# Altium project SAMA7D65-Curiosity.PrjPcb (part 1 of 12)
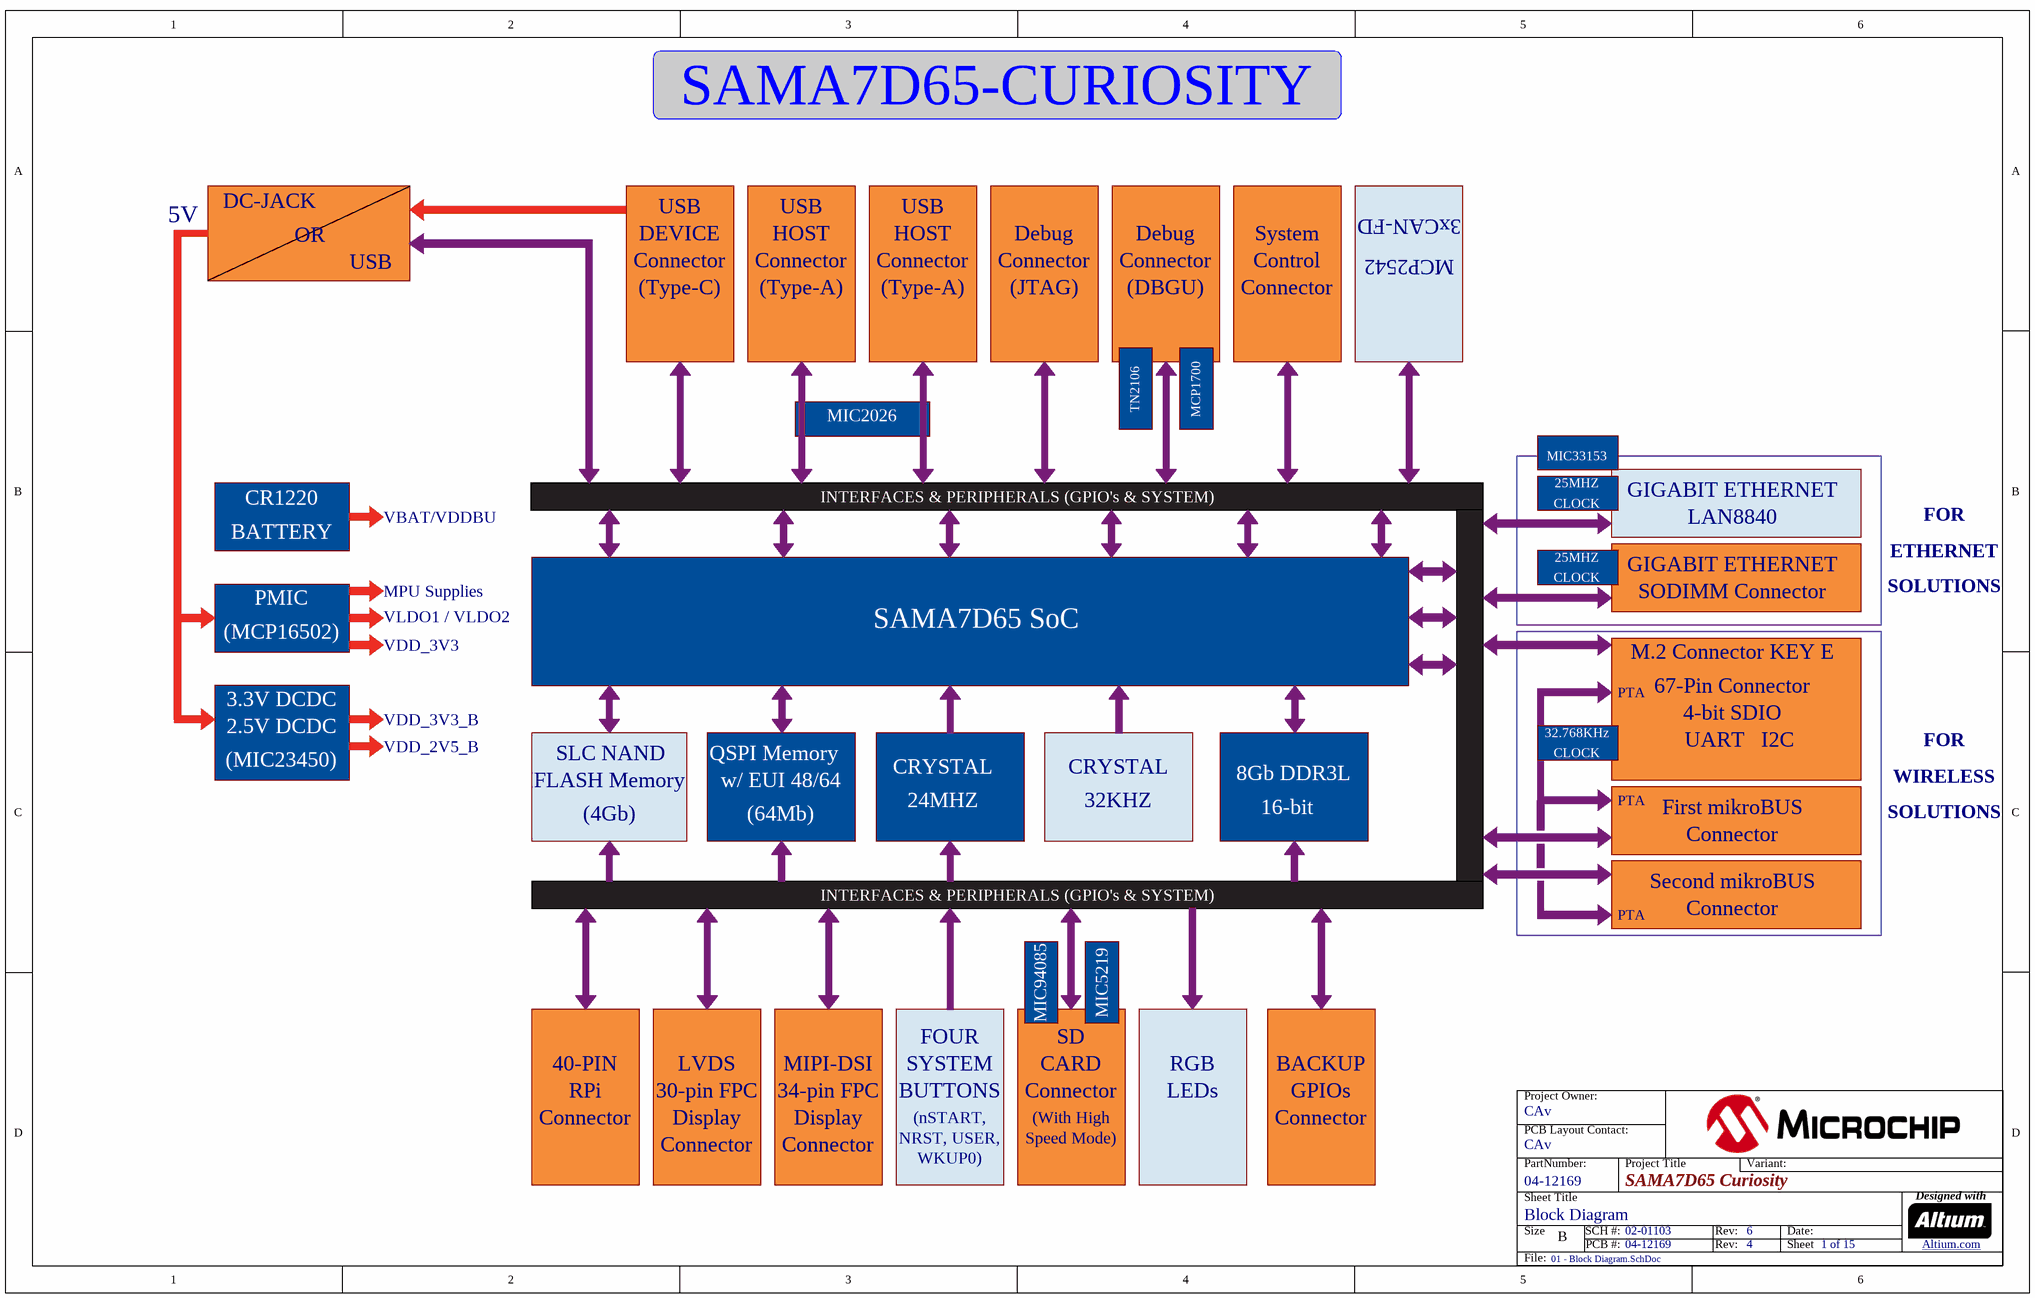
[diagram p0: 01 - Block Diagram.SchDoc]
ProjectTitle: SAMA7D65 Curiosity; ProjectPCBFabRevision: 4; ProjectPCBFabNumber: 04-12169; ProjectPCBAssyRevision: 6; ProjectPCBAssyNumber: 02-01103; ProjectPartNumber: 04-12169; ProjectContactPCB: CAv; ProjectContactOwner: CAv
15 sheets, 624 parts. Net scope: flat (ports and power ports of the same name join across sheets).
Board file: SAMA7D65-Curiosity.PcbDoc
Sheets:
  01 - Block Diagram.SchDoc
  02 - PIO muxing.SchDoc
  03 - Power.SchDoc
  04 - PMIC-PWR Monitor.SchDoc
  05 - SAMA7D65-MPU.SchDoc
  06 - SAMA7D65-DDR3L.SchDoc
  07 - SAMA7D65-PIO.SchDoc
  08 - Memories.SchDoc
  09 - M.2-SDMMC2.SchDoc
  10 - GMAC0.SchDoc
  11 - GMAC1-SODIMM.SchDoc
  12 - MIPI-LVDS-RGB.SchDoc
  13 - USB.SchDoc
  14 - mBUS-CAN.SchDoc
  15 - LED-User-Debug.SchDoc

## Sheet 01 - Block Diagram.SchDoc
size B; CompanyName: Microchip Technology Inc.; Organization: Microchip Technology; Address1: 2355 West Chandler Blvd.; Address2: Chandler, AZ  85224; Address4: USA; DocumentNumber: 1; SheetNumber: 1; SheetTotal: 15; SheetTitle: Block Diagram; Time: Time

### Notes on the sheet
- SAMA7D65-CURIOSITY
- 5V
- DC-JACK
- OR
- DEVICE
- USB
- HOST
- Debug
- System
- 3xCAN-FD
- (Type-C)
- Connector
- (Type-A)
- (JTAG)
- (DBGU)
- Control
- MCP2542
- MIC2026
- TN2106
- MCP1700
- CR1220
- VBAT/VDDBU
- INTERFACES & PERIPHERALS (GPIO's & SYSTEM)
- 25MHZ
- CLOCK
- MIC33153
- LAN8840
- GIGABIT ETHERNET
- FOR
- BATTERY
- ETHERNET
- PMIC
- (MCP16502)
- MPU Supplies
- VLDO1 / VLDO2
- VDD_3V3
- SAMA7D65 SoC
- M.2 Connector KEY E
- SODIMM Connector
- SOLUTIONS
- 1.8V DCDC
- 3.3V DCDC
- PTA
- 67-Pin Connector
- 4-bit SDIO
- (MIC5353)
- 2.5V DCDC
- (MIC23450)
- VDD_3V3_B
- VDD_2V5_B
- FLASH Memory
- SLC NAND
- QSPI Memory
- w/ EUI 48/64
- CRYSTAL
- 8Gb DDR3L
- 32.768KHz
- UART   I2C
- WIRELESS
- (4Gb)
- (64Mb)
- 24MHZ
- 32KHZ
- 16-bit
- First mikroBUS
- Second mikroBUS
- MIC94085
- MIC5219
- FOUR
- SD
- RPi
- 40-PIN
- LVDS
- Display
- 30-pin FPC
- MIPI-DSI
- 34-pin FPC
- SYSTEM
- BUTTONS
- (nSTART,
- CARD
- (With High
- RGB
- LEDs
- BACKUP
- GPIOs
- NRST, USER,
- WKUP0)
- Speed Mode)
- Project Owner:
- PCB Layout Contact:
- PartNumber:
- Project Title
- Variant:
- Sheet Title
- Size
- B
- SCH #:
- PCB #:
- Rev:
- Date:
- Sheet
- Designed with
- Altium.com <http://go.altium.com/MicrochipLandingPage_Evaluation.html>
- File:

## Sheet 02 - PIO muxing.SchDoc
size B; CompanyName: Microchip Technology Inc.; Organization: Microchip Technology; Address1: 2355 West Chandler Blvd.; Address2: Chandler, AZ  85224; Address4: USA; DocumentNumber: 2; SheetNumber: 2; SheetTotal: 15; SheetTitle: PIO Muxing; Time: Time
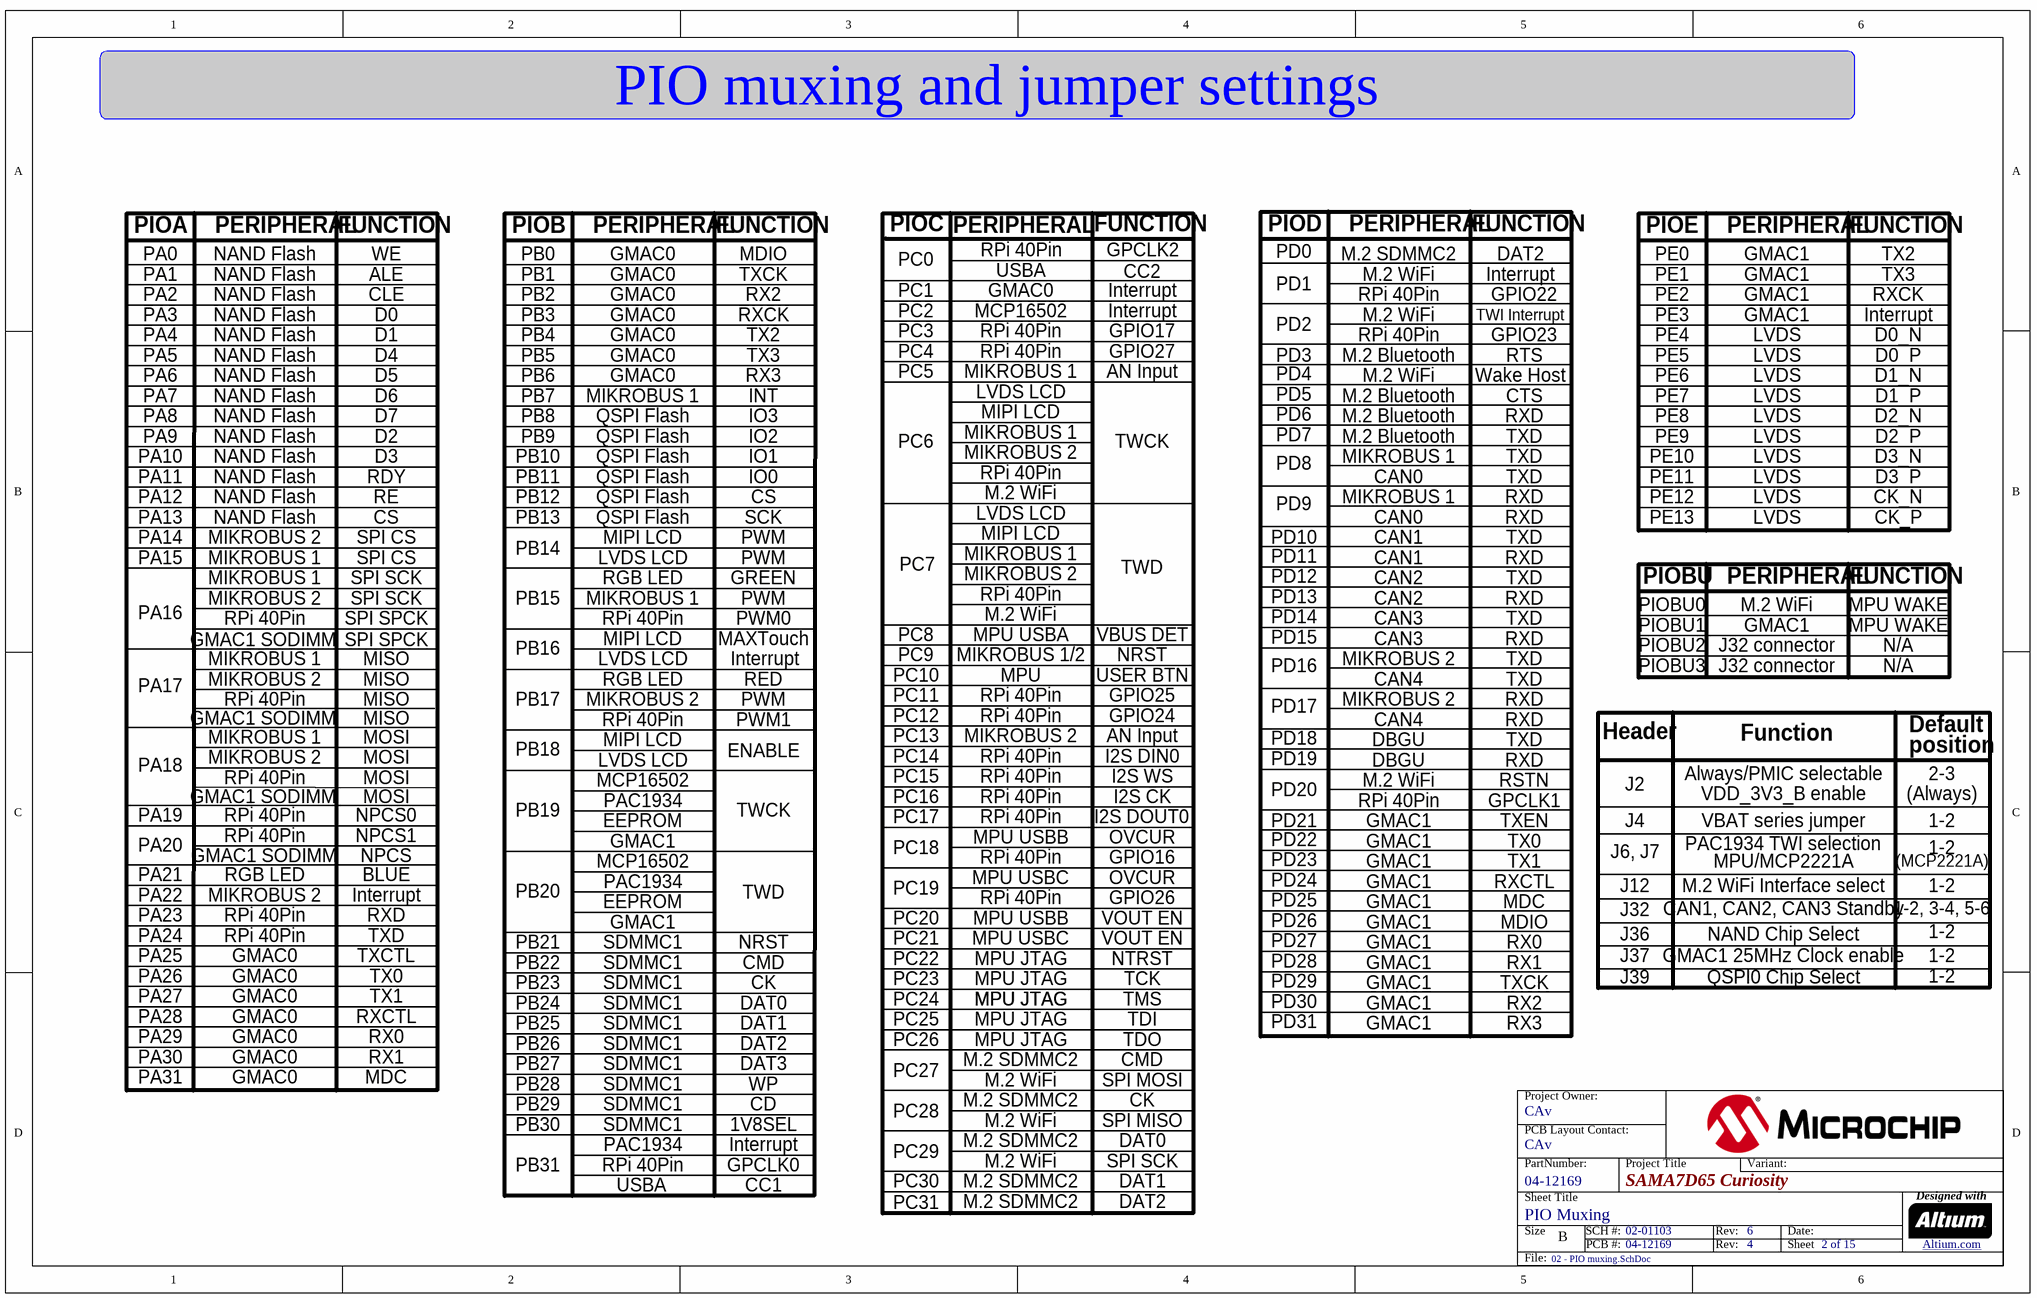
[diagram p1: 02 - PIO muxing.SchDoc]

### Notes on the sheet
- PIO muxing and jumper settings
- PIOA
- PERIPHERAL
- FUNCTION
- PIOB
- PIOC
- PIOD
- PIOE
- PA0
- PA1
- PA2
- NAND Flash
- WE
- ALE
- CLE
- PB0
- PB1
- PB2
- GMAC0
- MDIO
- TXCK
- RX2
- PC0
- PC1
- PC2
- MCP16502
- USBA
- RPi 40Pin
- Interrupt
- CC2
- GPCLK2
- PD0
- PD1
- M.2 SDMMC2
- M.2 WiFi
- DAT2
- GPIO22
- PE0
- PE1
- PE2
- GMAC1
- TX2
- TX3
- RXCK
- PA3
- PA4
- PA5
- PA6
- D0
- D1
- D4
- D5
- PB3
- PB4
- PB5
- PB6
- RX3
- PC3
- PC4
- PC5
- MIKROBUS 1
- GPIO17
- GPIO27
- AN Input
- PD2
- PD3
- PD4
- M.2 Bluetooth
- TWI Interrupt
- Wake Host
- GPIO23
- RTS
- PE3
- PE4
- PE5
- PE6
- LVDS
- D0_N
- D0_P
- D1_N
- PA7
- PA8
- PA9
- D2
- D6
- D7
- PB7
- PB8
- PB9
- QSPI Flash
- INT
- IO3
- IO2
- PC6
- LVDS LCD
- MIPI LCD
- TWCK
- PD5
- PD6
- PD7
- CTS
- RXD
- TXD
- PE7
- PE8
- PE9
- D2_P
- D1_P
- D2_N
- PA10
- PA11
- PA12
- PA13
- D3
- RDY
- RE
- CS
- PB10
- PB11
- PB12
- PB13
- IO1
- IO0
- SCK
- MIKROBUS 2
- PD8
- PD9
- CAN0
- PE10
- PE11
- PE12
- PE13
- D3_N
- D3_P
- CK_N
- CK_P
- PA14
- PA15
- SPI CS
- SPI SCK
- PB14
- RGB LED
- PWM
- GREEN
- PC7
- TWD
- PD10
- PD11
- PD12
- CAN1
- CAN2
- PA16
- GMAC1 SODIMM
- SPI SPCK
- PB15
- PB16
- PWM0
- MAXTouch
- PC8
- MPU USBA
- VBUS DET
- PD13
- PD14
- PD15
- CAN3
- PIOBU
- PIOBU0
- PIOBU1
- PIOBU2
- J32 connector
- MPU WAKE
- N/A
- PA17
- MISO
- PB17
- RED
- PC9
- PC10
- PC11
- PC12
- MIKROBUS 1/2
- MPU
- NRST
- USER BTN
- GPIO25
- GPIO24
- PD16
- PD17
- CAN4
- PIOBU3
- PA18
- MOSI
- PB18
- PWM1
- ENABLE
- PC13
- PC14
- PC15
- I2S DIN0
- I2S WS
- PD18
- PD19
- DBGU
- RSTN
- Header
- J2
- Always/PMIC selectable
- Function
- Default
- position
- 2-3
- PA19
- PA20
- NPCS0
- NPCS1
- PB19
- PAC1934
- EEPROM
- PC16
- PC17
- PC18
- MPU USBB
- I2S DOUT0
- I2S CK
- OVCUR
- PD20
- PD21
- PD22
- GPCLK1
- TXEN
- TX0
- J4
- J6, J7
- PAC1934 TWI selection
- VDD_3V3_B enable
- VBAT series jumper
- (Always)
- 1-2
- PA21
- PA22
- PA23
- BLUE
- NPCS
- PB20
- PC19
- PC20
- MPU USBC
- GPIO16
- GPIO26
- VOUT EN
- PD23
- PD24
- PD25
- PD26
- TX1
- RXCTL
- MDC
- J12
- J32
- MPU/MCP2221A
- M.2 WiFi Interface select
- CAN1, CAN2, CAN3 Standby
- (MCP2221A)
- 1-2, 3-4, 5-6
- PA24
- PA25
- PA26
- TXCTL
- PB21
- PB22
- PB23
- SDMMC1
- CMD
- CK
- PC21
- PC22
- PC23
- MPU JTAG
- NTRST
- TCK
- PD27
- PD28
- PD29
- RX0
- RX1
- J36
- J39
- J37
- NAND Chip Select
- QSPI0 Chip Select
- GMAC1 25MHz Clock enable
- PA27
- PA28
- PA29
- PA30
- PB24
- PB25
- PB26
- DAT0
- DAT1
- PC24
- PC25
- PC26
- TMS
- TDI
- TDO
- PD30
- PD31
- PA31
- PB27
- PB28
- PB29
- DAT3
- WP
- CD
- PC27
- PC28
- SPI MOSI
- SPI MISO
- PB30
- PB31
- 1V8SEL
- GPCLK0
- CC1
- PC29
- PC30
- PC31
- Project Owner:
- PCB Layout Contact:
- PartNumber:
- Project Title
- Variant:
- Sheet Title
- Size
- B
- SCH #:
- PCB #:
- Rev:
- Date:
- Sheet
- Designed with
- Altium.com <http://go.altium.com/MicrochipLandingPage_Evaluation.html>
- File:

## Sheet 03 - Power.SchDoc
size B; CompanyName: Microchip Technology Inc.; Organization: Microchip Technology; Address1: 2355 West Chandler Blvd.; Address2: Chandler, AZ  85224; Address4: USA; DocumentNumber: 3; SheetNumber: 3; SheetTotal: 15; SheetTitle: Power Supply
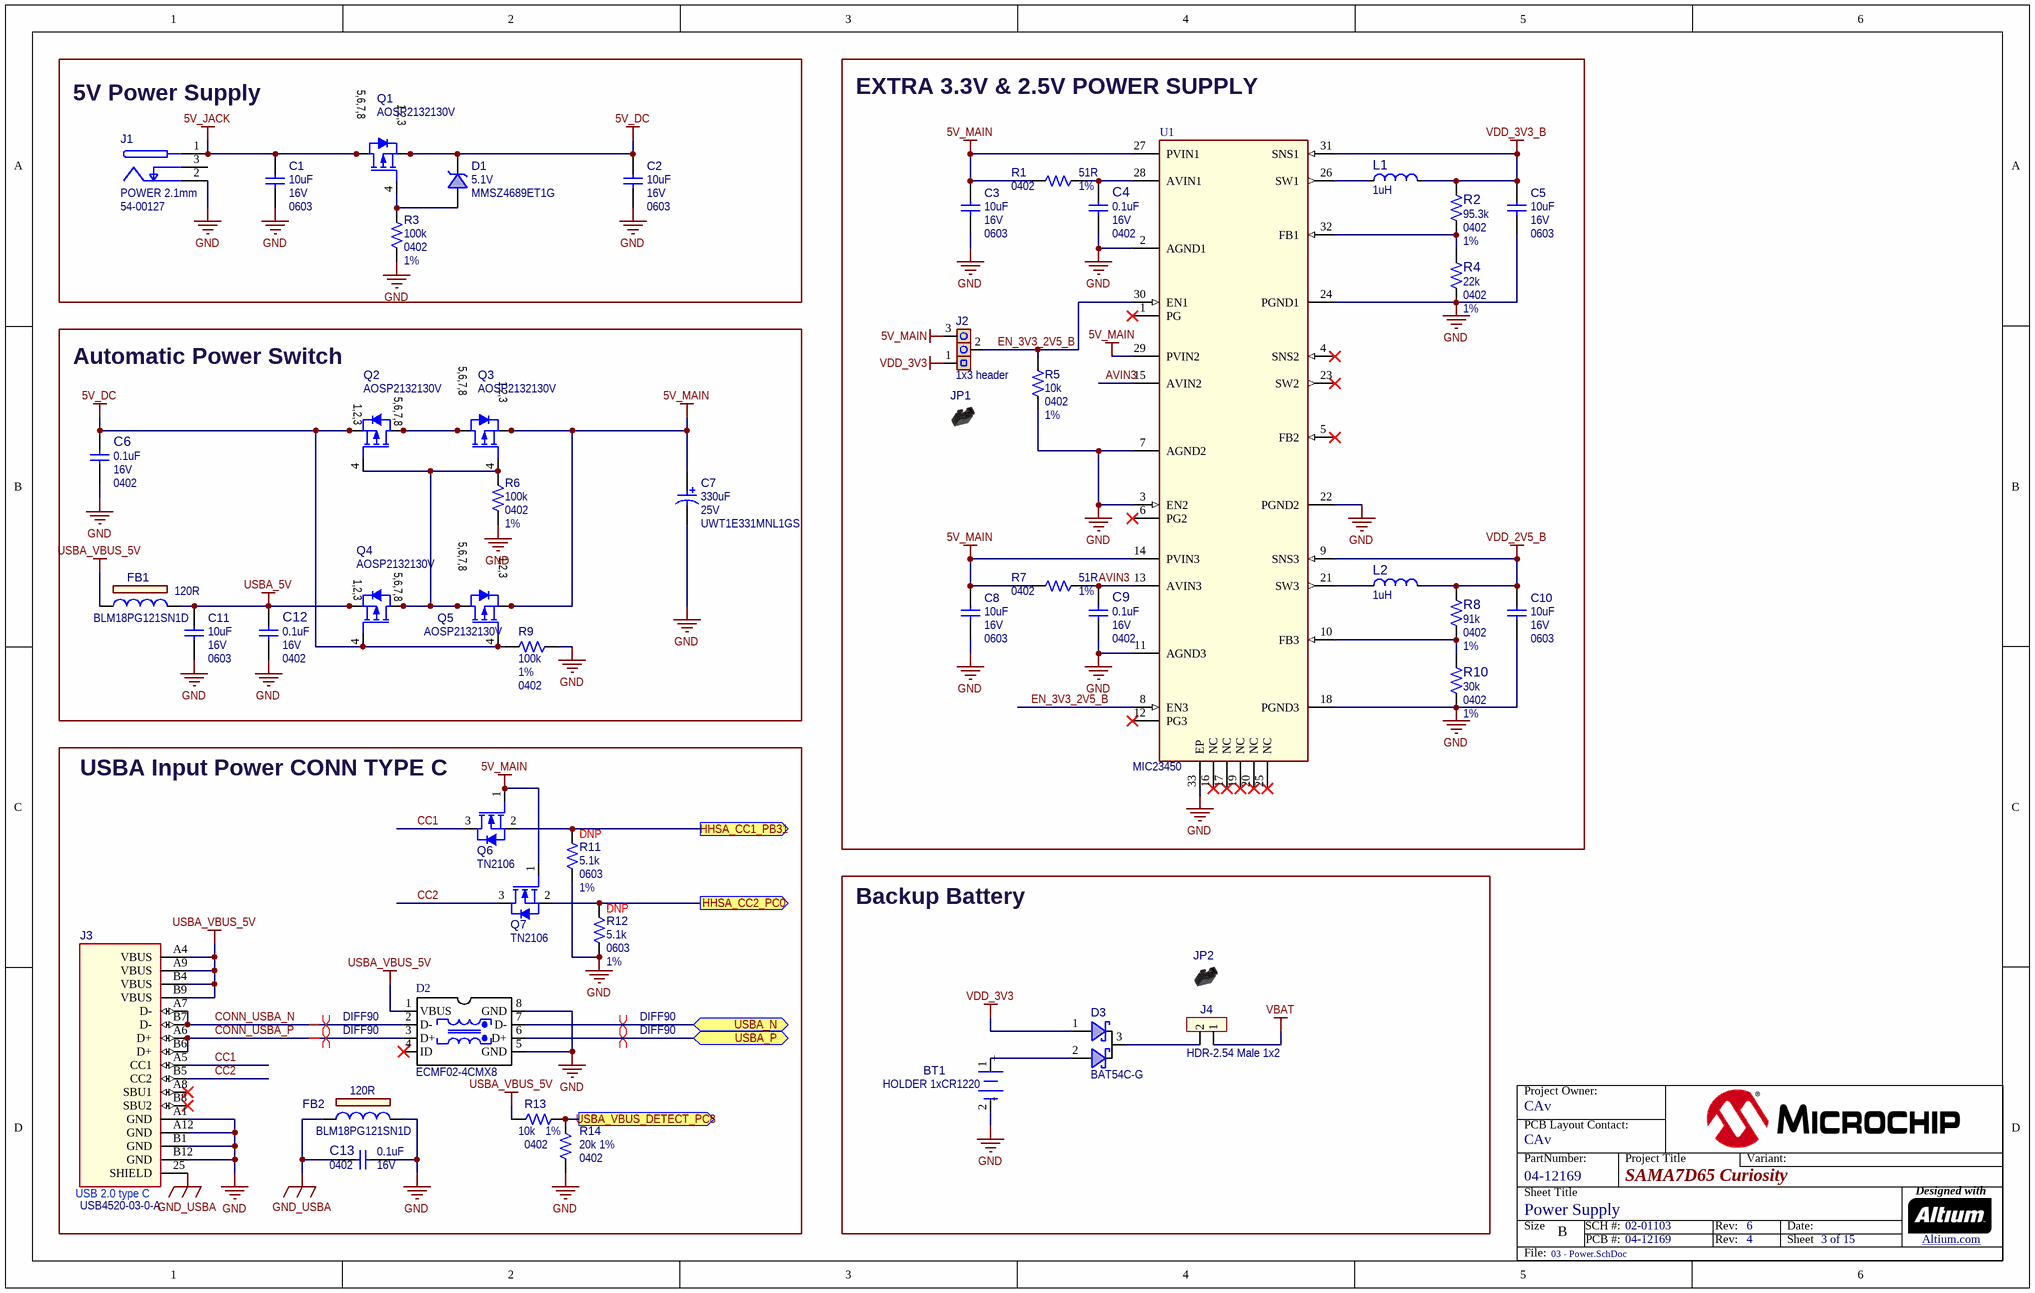
[diagram p2: 03 - Power.SchDoc]

### Parts
BT1  value HOLDER 1xCR1220  [BATT_HOLDER_12MM_3001]  (hidden comment: Battery 2 Pin)
C1  value 10uF  Voltage: 16V  Package: 0603  [CAP_C_0603]  (hidden comment: Capacitor NP)
C2  value 10uF  Voltage: 16V  Package: 0603  [CAP_C_0603]  (hidden comment: Capacitor NP)
C3  value 10uF  Voltage: 16V  Package: 0603  [CAP_C_0603]  (hidden comment: Capacitor NP)
C4  value 0.1uF  Voltage: 16V  Package: 0402  [CAP_C_0402]  (hidden comment: Capacitor NP)
C5  value 10uF  Voltage: 16V  Package: 0603  [CAP_C_0603]  (hidden comment: Capacitor NP)
C6  value 0.1uF  Voltage: 16V  Package: 0402  [CAP_C_0402]  (hidden comment: Capacitor NP)
C7  value 330uF  Voltage: 25V  Manufacturer Part Number 1: UWT1E331MNL1GS  [CAP_AL_F]  (hidden comment: Capacitor POL)
C8  value 10uF  Voltage: 16V  Package: 0603  [CAP_C_0603]  (hidden comment: Capacitor NP)
C9  value 0.1uF  Voltage: 16V  Package: 0402  [CAP_C_0402]  (hidden comment: Capacitor NP)
C10  value 10uF  Voltage: 16V  Package: 0603  [CAP_C_0603]  (hidden comment: Capacitor NP)
C11  value 10uF  Voltage: 16V  Package: 0603  [CAP_C_0603]  (hidden comment: Capacitor NP)
C12  value 0.1uF  Voltage: 16V  Package: 0402  [CAP_C_0402]  (hidden comment: Capacitor NP)
C13  value 0.1uF  Voltage: 16V  Package: 0402  [CAP_C_0402]  (hidden comment: Capacitor NP)
D1  value 5.1V  Manufacturer Part Number 1: MMSZ4689ET1G  [SOD-123]  (hidden comment: Diode Zener)
D2  value ECMF02-4CMX8  [DIODE ESD ECMF02-4CMX8]  (hidden comment: ESD_ECMF02-4CMX8)
D3  value BAT54C-G  [SOT-23-3]  (hidden comment: Diode Schottky Dual CK)
FB1  value 120R  Manufacturer Part Number 1: BLM18PG121SN1D  [IND_C_0603]  (hidden comment: Ferrite Bead)
FB2  value 120R  Manufacturer Part Number 1: BLM18PG121SN1D  [IND_C_0603]  (hidden comment: Ferrite Bead)
J1  value POWER 2.1mm  Manufacturer Part Number 1: 54-00127  [CON_JACK_POWER_TH_RA_PJ-ID2.10 OD5.50]  (hidden comment: CON JACK 2C 3P SPST)
J2  value 1x3 header  [HDR_M_2.54_1x3]  (hidden comment: Header 1x3)
J3  value USB4520-03-0-A  [CON_USB2.0-C_SMD_RA_USB4520]  (hidden comment: CON USB-2.0 C)
J4  value HDR-2.54 Male 1x2  [HDR_M_2.54_1x2]  (hidden comment: Header 1x2)
JP1  Jumper Mechanical  [Jumper_Mechanical]  (value not drawn)  (mechanical)
JP2  Jumper Mechanical  [Jumper_Mechanical]  (value not drawn)  (mechanical)
L1  value 1uH  [IND_C_1212]  (hidden comment: Inductor)
L2  value 1uH  [IND_C_1212]  (hidden comment: Inductor)
Q1  value AOSP2132130V  [SOIC-8]  (hidden comment: Transistor MOS-P SSSGDDDD)
Q2  value AOSP2132130V  [SOIC-8]  (hidden comment: Transistor MOS-P SSSGDDDD)
Q3  value AOSP2132130V  [SOIC-8]  (hidden comment: Transistor MOS-P SSSGDDDD)
Q4  value AOSP2132130V  [SOIC-8]  (hidden comment: Transistor MOS-P SSSGDDDD)
Q5  value AOSP2132130V  [SOIC-8]  (hidden comment: Transistor MOS-P SSSGDDDD)
Q6  value TN2106  [SOT-23-3]  (hidden comment: Transistor MOS-N GSD)
Q7  value TN2106  [SOT-23-3]  (hidden comment: Transistor MOS-N GSD)
R1  value 51R  Package: 0402  Tolerance: 1%  [RES_C_0402]  (hidden comment: Resistor)
R2  value 95.3k  Package: 0402  Tolerance: 1%  [RES_C_0402]  (hidden comment: Resistor)
R3  value 100k  Package: 0402  Tolerance: 1%  [RES_C_0402]  (hidden comment: Resistor)
R4  value 22k  Package: 0402  Tolerance: 1%  [RES_C_0402]  (hidden comment: Resistor)
R5  value 10k  Package: 0402  Tolerance: 1%  [RES_C_0402]  (hidden comment: Resistor)
R6  value 100k  Package: 0402  Tolerance: 1%  [RES_C_0402]  (hidden comment: Resistor)
R7  value 51R  Package: 0402  Tolerance: 1%  [RES_C_0402]  (hidden comment: Resistor)
R8  value 91k  Package: 0402  Tolerance: 1%  [RES_C_0402]  (hidden comment: Resistor)
R9  value 100k  Package: 0402  Tolerance: 1%  [RES_C_0402]  (hidden comment: Resistor)
R10  value 30k  Package: 0402  Tolerance: 1%  [RES_C_0402]  (hidden comment: Resistor)
R11  value 5.1k  Package: 0603  Tolerance: 1%  Populated: DNP  [RES_C_0603]  (hidden comment: Resistor)
R12  value 5.1k  Package: 0603  Tolerance: 1%  Populated: DNP  [RES_C_0603]  (hidden comment: Resistor)
R13  value 10k  Package: 0402  Tolerance: 1%  [RES_C_0402]  (hidden comment: Resistor)
R14  value 20k  Package: 0402  Tolerance: 1%  [RES_C_0402]  (hidden comment: Resistor)
U1  value MIC23450  [QFN-32_5X5_EP3.1X3.1]  (hidden comment: MIC23450 QFN-32)

### Blocks framed on the sheet
5V Power Supply: C1 C2 D1 J1 Q1 R3
EXTRA 3.3V & 2.5V POWER SUPPLY: C3-C5 C8-C10 J2 JP1 L1 L2 R1 R2 R4 R5 R7 R8 R10 U1
Automatic Power Switch: C6 C7 C11 C12 FB1 Q2-Q5 R6 R9
USBA Input Power CONN TYPE C: C13 D2 FB2 J3 Q6 Q7 R11-R14
Backup Battery: BT1 D3 J4 JP2

### Ports
HHSA_CC1_PB31 (out), HHSA_CC2_PC0 (out), USBA_N (bidir), USBA_P (bidir), USBA_VBUS_DETECT_PC8 (out)

### Nets
5V_DC: C2.1 C6.2 D1.2(K) Q1.1(S) Q1.2(S) Q1.3(S) Q2.1(S) Q2.2(S) Q2.3(S) Q4.4(G) Q5.4(G) R9.2
5V_JACK: C1.1 J1.1(PLUS) Q1.5(D) Q1.6(D) Q1.7(D) Q1.8(D)
5V_MAIN: C3.1 C7.1 C8.1 J2.3 Q3.1(S) Q3.2(S) Q3.3(S) Q5.1(S) Q5.2(S) Q5.3(S) Q6.1(G) Q7.1(G) R1.2 R7.2 U1.14(PVIN3) U1.27(PVIN1) U1.29(PVIN2)
GND: BT1.2(-) C1.2 C2.2 C3.2 C4.1 C5.2 C6.1 C7.2 C8.2 C9.1 C10.2 C11.2 C12.1 C13.2 D2.5(GND) D2.8(GND) FB2.2 J1.2(COM) J3.A1(GND) J3.A12(GND) J3.B1(GND) J3.B12(GND) R3.1 R4.1 R5.1 R6.1 R9.1 R10.1 R11.2 R12.2 R14.1 U1.2(AGND1) U1.3(EN2) U1.7(AGND2) U1.11(AGND3) U1.18(PGND3) U1.22(PGND2) U1.24(PGND1) U1.33(EP)
GND_USBA: C13.1 FB2.1 J3.25(SHIELD)
USBA_5V: C11.1 C12.2 FB1.2 Q4.1(S) Q4.2(S) Q4.3(S)
USBA_VBUS_5V: D2.1(VBUS) FB1.1 J3.A4(VBUS) J3.A9(VBUS) J3.B4(VBUS) J3.B9(VBUS) R13.1
VBAT: J4.1
VDD_2V5_B: C10.1 L2.2(F) R8.1 U1.9(SNS3)
VDD_3V3: D3.1(A) J2.1
VDD_3V3_B: C5.1 L1.2(F) R2.1 U1.31(SNS1)
AVIN3: C9.2 R7.1 U1.13(AVIN3) U1.15(AVIN2)
CC1: J3.A5(CC1) Q6.3(D)
CC2: J3.B5(CC2) Q7.3(D)
CONN_USBA_N: D2.2(D-) J3.A7(D-) J3.B7(D-)
CONN_USBA_P: D2.3(D+) J3.A6(D+) J3.B6(D+)
EN_3V3_2V5_B: J2.2 R5.2 U1.8(EN3) U1.30(EN1)
HHSA_CC1_PB31: Q6.2(S) R11.1 ; port HHSA_CC1_PB31
HHSA_CC2_PC0: Q7.2(S) R12.1 ; port HHSA_CC2_PC0
USBA_N: D2.7(D-) ; port USBA_N
USBA_P: D2.6(D+) ; port USBA_P
USBA_VBUS_DETECT_PC8: R13.2 R14.2 ; port USBA_VBUS_DETECT_PC8
NetBT1_1: BT1.1(+) D3.2(A)
NetC4_2: C4.2 R1.1 U1.28(AVIN1)
NetD1_1: D1.1(A) Q1.4(G) R3.2
NetD3_3: D3.3(KK) J4.2
NetL1_1: L1.1(S) U1.26(SW1)
NetL2_1: L2.1(S) U1.21(SW3)
NetQ2_4: Q2.4(G) Q3.4(G) Q4.5(D) Q4.6(D) Q4.7(D) Q4.8(D) Q5.5(D) Q5.6(D) Q5.7(D) Q5.8(D) R6.2
NetQ2_5: Q2.5(D) Q2.6(D) Q2.7(D) Q2.8(D) Q3.5(D) Q3.6(D) Q3.7(D) Q3.8(D)
NetR2_2: R2.2 R4.2 U1.32(FB1)
NetR8_2: R8.2 R10.2 U1.10(FB3)

Not connected (* = marked no-connect by the designer): D2 4(ID)*; J1 3(SWITCH); J3 A8(SBU1)* B8(SBU2)*; U1 1(PG)* 4(SNS2)* 5(FB2)* 6(PG2)* 12(PG3)* 16(NC)* 17(NC)* 19(NC)* 20(NC)* 23(SW2)* 25(NC)*

### Layout directives
differential pair; differential pair class DIFF90; net class DIFF90; rule Matched Net Lengths [Tolerance = 4mil]: CONN_USBA_N, CONN_USBA_P, USBA_N, USBA_P

### Notes on the sheet
- Project Owner:
- PCB Layout Contact:
- PartNumber:
- Project Title
- Variant:
- Sheet Title
- Size
- B
- SCH #:
- PCB #:
- Rev:
- Date:
- Sheet
- Designed with
- Altium.com <http://go.altium.com/MicrochipLandingPage_Evaluation.html>
- File:
- (in symbol CON2634) USB 2.0 type C
- (in symbol TRA1639) 5,6,7,8; 1,2,3

### Library data of the parts
BT1 = BAT1034: Battery; Manufacturer 1: Keystone Electronics; Manufacturer Part Number 1: 3001; Description_: BATT HOLDER 1 COIN 12MM TH 3V; Dev Tools Status: Design; Owner: Sam Charles; Voltage: 3V; Chemistry: Li; Capacity: 35mAh; Populated: YES; MCHP-ID: BAT1034; Revision: A; Symbol: Battery 2 Pin; Status: MCL Design; ComponentLink1URL: https://chn-vm-apps.microchip.com/mchprepo/parts/Datasheets/3001.PDF; ComponentLink1Description: SVN Datasheet; ComponentLink2URL: C:\ALTIUM_WORK\00001_MCHP-CDB\Datasheets\3001.PDF; ComponentLink2Description: Local Datasheet; ComponentLink3URL: C:\ALTIUM_WORK\00001_MCHP-CDB\Library\LibraryRefs\Battery 2 Pin.SchLib; ComponentLink3Description: Open Symbol; ComponentLink4URL: C:\ALTIUM_WORK\00001_MCHP-CDB\Library\Footprints\BATT_HOLDER_12MM_3001.PcbLib; ComponentLink4Description: Open Footprint; ComponentLink5Description: Open Footprint 2; ComponentLink6Description: Open Footprint 3; ComponentLink7Description: Open Footprint 4; Type: Holder; Category: Battery; Supplier 1: Digi-Key; Supplier Part Number 1: 36-3001-ND; Quantity Override: 1
C1-C3 C5 C8 C10 C11 = CAP2397: Manufacturer 1: Murata; Manufacturer Part Number 1: GRT188R61C106KE13D; Description_: CAP CER 10uF 16V 10% X5R SMD 0603 AEC-Q200; Dev Tools Status: Design; Tolerance: 10%; Temperature Coefficient: X5R; Type: Ceramic; Populated: YES; Owner: Sam Charles; MCHP-ID: CAP2397; Revision: 1; Symbol: Capacitor NP; Status: MCL Design; ComponentLink1URL: https://chn-vm-apps.microchip.com/mchprepo/parts/Datasheets/GRT188R61C106KE13-01.pdf; ComponentLink1Description: SVN Datasheet; ComponentLink2URL: C:\ALTIUM_WORK\00001_MCHP-CDB\Datasheets\GRT188R61C106KE13-01.pdf; ComponentLink2Description: Local Datasheet; ComponentLink3URL: C:\ALTIUM_WORK\00001_MCHP-CDB\Library\LibraryRefs\Capacitor NP.SchLib; ComponentLink3Description: Open Symbol; ComponentLink4URL: C:\ALTIUM_WORK\00001_MCHP-CDB\Library\Footprints\CAP_C_0603.PcbLib; ComponentLink4Description: Open Footprint; ComponentLink5Description: Open Footprint 2; ComponentLink6Description: Open Footprint 3; ComponentLink7Description: Open Footprint 4; Operating Temperature: -55°C ~ 85°C; Category: Capacitor; Supplier 1: Digi-Key; Supplier Part Number 1: 490-12317-1-ND; Quantity Override: 1
C4 C6 C9 C12 = CAP1033: Manufacturer 1: Hottech; Manufacturer Part Number 1: C1005B104K160NT; Description_: CAP CER 0.1uF 16V 10% X7R SMD 0402; Dev Tools Status: Production; Tolerance: 10%; Type: Ceramic; Owner: Sompoch Loboonlert; Populated: Yes; Temperature Coefficient: X7R; Restricted Sourcing: No; MCHP-ID: CAP1033; Revision: 10; Symbol: Capacitor NP; Status: MCL Design; ComponentLink1URL: https://chn-vm-apps.microchip.com/mchprepo/parts/Datasheets/L0005E.pdf; ComponentLink1Description: SVN Datasheet; ComponentLink2URL: C:\ALTIUM_WORK\00001_MCHP-CDB\Datasheets\L0005E.pdf; ComponentLink2Description: Local Datasheet; ComponentLink3URL: C:\ALTIUM_WORK\00001_MCHP-CDB\Library\LibraryRefs\Capacitor NP.SchLib; ComponentLink3Description: Open Symbol; ComponentLink4URL: C:\ALTIUM_WORK\00001_MCHP-CDB\Library\Footprints\CAP_C_0402.PcbLib; ComponentLink4Description: Open Footprint; ComponentLink5Description: Open Footprint 2; ComponentLink6Description: Open Footprint 3; ComponentLink7Description: Open Footprint 4; Operating Temperature: -55C to +125C; Category: Capacitor; Manufacturer 2: KEMET; Manufacturer Part Number 2: C0402C104K4RAC7867; Manufacturer 3: Samsung Electro-Mechanics; Manufacturer Part Number 3: CL05B104KO5NNNC; Supplier 1: Hottech; Supplier Part Number 1: C1005B104K160NT; Supplier 2: Digi-Key; Supplier Part Number 2: 399-C0402C104K4RAC7867TR-ND; Supplier 3: Digi-Key; Supplier Part Number 3: 1276-1001-1-ND; Quantity Override: 1; Manufacturer 4: Würth Elektronik; Manufacturer Part Number 4: 885012205037; Manufacturer 5: Samsung Electro-Mechanics; Manufacturer Part Number 5: CL05B104KO5NNND; Manufacturer 6: Samsung Electro-Mechanics; Manufacturer Part Number 6: CL05B104KO5NNNO; Manufacturer 7: Yageo; Manufacturer Part Number 7: CC0402KRX7R7BB104; Supplier 4: Digi-Key; Supplier Part Number 4: 732-7532-1-ND; Supplier 5: Mouser; Supplier Part Number 5: 187-CL05B104KO5NNND; Supplier 6: Samsung Electro-Mechanics; Supplier Part Number 6: CL05B104KO5NNNO; Supplier 7: Yageo; Supplier Part Number 7: CC0402KRX7R7BB104
C7 = CAP0508: Capacitor; Manufacturer 1: Nichicon; Description_: CAP ALU 330uF 25V 20% SMD F; Dev Tools Status: Production; Tolerance: 20%; Type: Aluminum; Populated: YES; MCHP-ID: CAP0508; Package: AL-F; Revision: 1; Symbol: Capacitor POL; Status: MCL Design; ComponentLink1URL: https://chn-vm-apps.microchip.com/mchprepo/parts/Datasheets/e-wt.pdf; ComponentLink1Description: SVN Datasheet; ComponentLink2URL: C:\ALTIUM_WORK\00001_MCHP-CDB\Datasheets\e-wt.pdf; ComponentLink2Description: Local Datasheet; ComponentLink3URL: C:\ALTIUM_WORK\00001_MCHP-CDB\Library\LibraryRefs\Capacitor POL.SchLib; ComponentLink3Description: Open Symbol; ComponentLink4URL: C:\ALTIUM_WORK\00001_MCHP-CDB\Library\Footprints\CAP_AL_F.PcbLib; ComponentLink4Description: Open Footprint; ComponentLink5Description: Open Footprint 2; ComponentLink6Description: Open Footprint 3; ComponentLink7Description: Open Footprint 4; Operating Temperature: -55C to +105C; Category: Capacitor; Supplier 1: Digi-Key; Supplier Part Number 1: 493-2193-1-ND; Quantity Override: 1
C13 = CAP1033: Manufacturer 1: Hottech; Manufacturer Part Number 1: C1005B104K160NT; Description_: CAP CER 0.1uF 16V 10% X7R SMD 0402; Dev Tools Status: Production; Tolerance: 10%; Temperature Coefficient: X7R; Type: Ceramic; Owner: Sompoch Loboonlert; Populated: Yes; Restricted Sourcing: No; MCHP-ID: CAP1033; Revision: 10; Symbol: Capacitor NP; Status: MCL Design; ComponentLink1URL: https://chn-vm-apps.microchip.com/mchprepo/parts/Datasheets/L0005E.pdf; ComponentLink1Description: SVN Datasheet; ComponentLink2URL: C:\ALTIUM_WORK\00001_MCHP-CDB\Datasheets\L0005E.pdf; ComponentLink2Description: Local Datasheet; ComponentLink3URL: C:\ALTIUM_WORK\00001_MCHP-CDB\Library\LibraryRefs\Capacitor NP.SchLib; ComponentLink3Description: Open Symbol; ComponentLink4URL: C:\ALTIUM_WORK\00001_MCHP-CDB\Library\Footprints\CAP_C_0402.PcbLib; ComponentLink4Description: Open Footprint; ComponentLink5Description: Open Footprint 2; ComponentLink6Description: Open Footprint 3; ComponentLink7Description: Open Footprint 4; Operating Temperature: -55C to +125C; Category: Capacitor; Supplier 1: Hottech; Supplier Part Number 1: C1005B104K160NT; Quantity Override: 1; Manufacturer 2: KEMET; Manufacturer Part Number 2: C0402C104K4RAC7867; Manufacturer 3: Samsung Electro-Mechanics; Manufacturer Part Number 3: CL05B104KO5NNNC; Manufacturer 4: Würth Elektronik; Manufacturer Part Number 4: 885012205037; Manufacturer 5: Samsung Electro-Mechanics; Manufacturer Part Number 5: CL05B104KO5NNND; Manufacturer 6: Samsung Electro-Mechanics; Manufacturer Part Number 6: CL05B104KO5NNNO; Manufacturer 7: Yageo; Manufacturer Part Number 7: CC0402KRX7R7BB104; Supplier 2: Digi-Key; Supplier Part Number 2: 399-C0402C104K4RAC7867TR-ND; Supplier 3: Digi-Key; Supplier Part Number 3: 1276-1001-1-ND; Supplier 4: Digi-Key; Supplier Part Number 4: 732-7532-1-ND; Supplier 5: Mouser; Supplier Part Number 5: 187-CL05B104KO5NNND; Supplier 6: Samsung Electro-Mechanics; Supplier Part Number 6: CL05B104KO5NNNO; Supplier 7: Yageo; Supplier Part Number 7: CC0402KRX7R7BB104
D1 = DIODE1230: Manufacturer 1: Fairchild Semiconductor; Description_: DIO ZNR MMSZ4689ET1G 5.1V 500mW SMD SOD-123; Dev Tools Status: Design; Type: Zener Single; Forward Current: 10mA; Power: 500mW; Reverse Current: 10µA; Reverse Voltage: 3V; Owner: Cristian Papuc; Populated: YES; MCHP-ID: DIODE1230; Revision: 1; Symbol: Diode Zener; Status: MCL Design; Package: SOD-123; ComponentLink1URL: https://chn-vm-apps.microchip.com/mchprepo/parts/Datasheets/SZ,MMSZ4yyyET1G SeriesG_Series.pdf; ComponentLink1Description: SVN Datasheet; ComponentLink2URL: C:\ALTIUM_WORK\00001_MCHP-CDB\Datasheets\SZ,MMSZ4yyyET1G SeriesG_Series.pdf; ComponentLink2Description: Local Datasheet; ComponentLink3URL: C:\ALTIUM_WORK\00001_MCHP-CDB\Library\LibraryRefs\Diode Zener.SchLib; ComponentLink3Description: Open Symbol; ComponentLink4URL: C:\ALTIUM_WORK\00001_MCHP-CDB\Library\Footprints\SOD-123.PcbLib; ComponentLink4Description: Open Footprint; ComponentLink5Description: Open Footprint 2; ComponentLink6Description: Open Footprint 3; ComponentLink7Description: Open Footprint 4; Operating Temperature: -55C to +150C; Category: Diode; Supplier 1: Digi-Key; Supplier Part Number 1: MMSZ4689ET1GOSCT-ND; Quantity Override: 1
D2 = IC1580: IC ESD FILTER COMM MODE 8-UQFN; Manufacturer 1: STMicroelectronics; MCHP-ID: IC1580; Description_: IC FILTER ECMF02-4CMX8 COMMON MODE ESD QFN-8L; Dev Tools Status: Production; Owner: Dragos Danaila; Populated: YES; Restricted Sourcing: No; Vin: 16V; Revision: 1; Symbol: DIODE ESD ECMF02-4CMX8; Status: MCL Design; Package: QFN-8L; ComponentLink1URL: https://chn-vm-apps.microchip.com/mchprepo/parts/Datasheets/en.DM00039389.pdf; ComponentLink1Description: SVN Datasheet; ComponentLink2URL: C:\ALTIUM_WORK\00001_MCHP-CDB\Datasheets\en.DM00039389.pdf; ComponentLink2Description: Local Datasheet; ComponentLink3URL: C:\ALTIUM_WORK\00001_MCHP-CDB\Library\LibraryRefs\DIODE ESD ECMF02-4CMX8.SchLib; ComponentLink3Description: Open Symbol; ComponentLink4URL: C:\ALTIUM_WORK\00001_MCHP-CDB\Library\Footprints\DIODE ESD ECMF02-4CMX8.PcbLib; ComponentLink4Description: Open Footprint; ComponentLink5Description: Open Footprint 2; ComponentLink6Description: Open Footprint 3; ComponentLink7Description: Open Footprint 4; Operating Temperature: -40C to +125C; Type: Filter; Category: IC; Manufacturer Part Number 1: ECMF02-4CMX8; Supplier 1: Digi-Key; Supplier Part Number 1: 497-13420-1-ND; Quantity Override: 1
D3 = DIODE1841: Manufacturer 1: Comchip Technology; Description_: DIO SCTKY ARRAY BAT54C-G 520mV 200mA 30V SMD SOT-23-3; Dev Tools Status: Production; Type: Schottky Array; Forward Current: 200mA; Power: 225mW; Reverse Current: 2mA; Reverse Recovery Time: 5ns; Reverse Voltage: 30V; Owner: Cristina Salanti; Populated: YES; Restricted Sourcing: No; MCHP-ID: DIODE1841; Revision: 1; Symbol: Diode Schottky Dual CK; Status: MCL Design; Package: SOT-23-3; ComponentLink1URL: https://chn-vm-apps.microchip.com/mchprepo/parts/Datasheets/BAT54.pdf; ComponentLink1Description: SVN Datasheet; ComponentLink2URL: C:\ALTIUM_WORK\00001_MCHP-CDB\Datasheets\BAT54.pdf; ComponentLink2Description: Local Datasheet; ComponentLink3URL: C:\ALTIUM_WORK\00001_MCHP-CDB\Library\LibraryRefs\Diode Schottky Dual CK.SchLib; ComponentLink3Description: Open Symbol; ComponentLink4URL: C:\ALTIUM_WORK\00001_MCHP-CDB\Library\Footprints\SOT-23-3.PcbLib; ComponentLink4Description: Open Footprint; ComponentLink5Description: Open Footprint 2; ComponentLink6Description: Open Footprint 3; ComponentLink7Description: Open Footprint 4; Operating Temperature: -55C to +125C; Category: Diode; Manufacturer Part Number 1: BAT54C-G; Supplier 1: Digi-Key; Supplier Part Number 1: 641-1320-1-ND; Quantity Override: 1
FB1 FB2 = IND1009: Manufacturer 1: Murata; Description_: FERRITE BEAD 120 OHM 0603 1LN; Dev Tools Status: Production; Owner: Petnarong Chaijaroong; DCR: 0.05R; Saturation Current: 12A; Populated: Yes; Restricted Sourcing: No; MCHP-ID: IND1009; Revision: 0; Symbol: Ferrite Bead; Status: MCL Design; ComponentLink1URL: https://chn-vm-apps.microchip.com/mchprepo/parts/Datasheets/L0110S0100BLM18P.pdf; ComponentLink1Description: SVN Datasheet; ComponentLink2URL: C:\ALTIUM_WORK\00001_MCHP-CDB\Datasheets\L0110S0100BLM18P.pdf; ComponentLink2Description: Local Datasheet; ComponentLink3URL: C:\ALTIUM_WORK\00001_MCHP-CDB\Library\LibraryRefs\Ferrite Bead.SchLib; ComponentLink3Description: Open Symbol; ComponentLink4URL: C:\ALTIUM_WORK\00001_MCHP-CDB\Library\Footprints\IND_C_0603.PcbLib; ComponentLink4Description: Open Footprint; ComponentLink5Description: Open Footprint 2; ComponentLink6Description: Open Footprint 3; ComponentLink7Description: Open Footprint 4; Operating Temperature: -55C to +125C; Package: 0603; Type: Ferrite Bead; Category: Inductor; Supplier 1: digikey; Supplier Part Number 1: 490-1037-1-ND; Quantity Override: 1
J1 = CON2145: Manufacturer 1: Tensility International Corp; Description_: CON POWER 2.1mm 5.5mm SWITCH TH R/A; Dev Tools Status: Design; Populated: YES; Owner: Narasimha Murthy; Voltage: 48V; Current: 6A; Custom Parameters: 1; MCHP-ID: CON2145; Revision: 1; Symbol: CON JACK 2C 3P SPST; Status: MCL Design; ComponentLink1URL: https://chn-vm-apps.microchip.com/mchprepo/parts/Datasheets/54-00127.pdf; ComponentLink1Description: SVN Datasheet; ComponentLink2URL: C:\ALTIUM_WORK\00001_MCHP-CDB\Datasheets\54-00127.pdf; ComponentLink2Description: Local Datasheet; ComponentLink3URL: C:\ALTIUM_WORK\00001_MCHP-CDB\Library\LibraryRefs\CON JACK 2C 3P SPST.SchLib; ComponentLink3Description: Open Symbol; ComponentLink4URL: C:\ALTIUM_WORK\00001_MCHP-CDB\Library\Footprints\CON_JACK_POWER_TH_RA_PJ-ID2.10 OD5.50.PcbLib; ComponentLink4Description: Open Footprint; ComponentLink5Description: Open Footprint 2; ComponentLink6Description: Open Footprint 3; ComponentLink7Description: Open Footprint 4; Type: Power; Category: Connector; Supplier 1: Digi-Key; Supplier Part Number 1: 839-1510-ND; Quantity Override: 1; Operating Temperature: -25C to +85C; Assembly Type: TH
J2 = CON2491: Manufacturer 1: METZ CONNECT USA Inc.; Manufacturer Part Number 1: PR20203VBNN; Description_: CON HDR-2.54 Male 1x3 Gold 6.10MH TH VERT; Dev Tools Status: Production; Owner: Dragos Danaila; Current: 3A; Populated: YES; MCHP-ID: CON2491; Revision: 2; Symbol: Header 1x3; Status: MCL Design; ComponentLink1URL: https://chn-vm-apps.microchip.com/mchprepo/parts/Datasheets/Data_sheet_PR202XXVBNN.PDF; ComponentLink1Description: SVN Datasheet; ComponentLink2URL: C:\ALTIUM_WORK\00001_MCHP-CDB\Datasheets\Data_sheet_PR202XXVBNN.PDF; ComponentLink2Description: Local Datasheet; ComponentLink3URL: C:\ALTIUM_WORK\00001_MCHP-CDB\Library\LibraryRefs\Header 1x3.SchLib; ComponentLink3Description: Open Symbol; ComponentLink4URL: C:\ALTIUM_WORK\00001_MCHP-CDB\Library\Footprints\HDR_M_2.54_1x3.PcbLib; ComponentLink4Description: Open Footprint; ComponentLink5Description: Open Footprint 2; ComponentLink6Description: Open Footprint 3; ComponentLink7Description: Open Footprint 4; Type: Header 2.54mm; Category: Connector; Supplier 1: Digi-Key; Supplier Part Number 1: Deprecated_1849-1003-ND; Quantity Override: 1; Operating Temperature: -40C to +105C; Assembly Type: TH
J3 = CON2634: USB 2.0 type C connector; Manufacturer 1: GCT; Description_: CONN USB2.0 TYPE-C Female SMD/TH R/A; Dev Tools Status: Design; Owner: Ciprian Abramov; Voltage: 20V; Current: 6.25A; Populated: YES; MCHP-ID: CON2634; Revision: 1; Symbol: CON USB2.0 C; Status: MCL Design; ComponentLink1URL: https://chn-vm-apps.microchip.com/mchprepo/parts/Datasheets/usb4520.pdf; ComponentLink1Description: SVN Datasheet; ComponentLink2URL: C:\ALTIUM_WORK\00001_MCHP-CDB\Datasheets\usb4520.pdf; ComponentLink2Description: Local Datasheet; ComponentLink3URL: C:\ALTIUM_WORK\00001_MCHP-CDB\Library\LibraryRefs\CON USB2.0 C.SchLib; ComponentLink3Description: Open Symbol; ComponentLink4URL: C:\ALTIUM_WORK\00001_MCHP-CDB\Library\Footprints\CON_USB2.0-C_SMD_RA_USB4520.PcbLib; ComponentLink4Description: Open Footprint; ComponentLink5Description: Open Footprint 2; ComponentLink6Description: Open Footprint 3; ComponentLink7Description: Open Footprint 4; Type: USB; Category: Connector; Manufacturer Part Number 1: USB4520-03-0-A; Supplier 1: Digi-Key; Supplier Part Number 1: 2073-USB4520-03-0-ACT-ND; Quantity Override: 1; Operating Temperature: -20C to +85C; Assembly Type: SMD
J4 = CON1632: Manufacturer 1: Würth Elektronik; Manufacturer Part Number 1: 61300211121; Description_: CON HDR-2.54 Male 1x2 Gold 5.84MH TH VERT; Dev Tools Status: Production; Owner: Narasimha Murthy; Populated: YES; Voltage: 250V; Current: 3A; MCHP-ID: CON1632; Revision: 3; Symbol: Header 1x2; Status: MCL Design; ComponentLink1URL: https://chn-vm-apps.microchip.com/mchprepo/parts/Datasheets/6130xx11121.pdf; ComponentLink1Description: SVN Datasheet; ComponentLink2URL: C:\ALTIUM_WORK\00001_MCHP-CDB\Datasheets\6130xx11121.pdf; ComponentLink2Description: Local Datasheet; ComponentLink3URL: C:\ALTIUM_WORK\00001_MCHP-CDB\Library\LibraryRefs\Header 1x2.SchLib; ComponentLink3Description: Open Symbol; ComponentLink4URL: C:\ALTIUM_WORK\00001_MCHP-CDB\Library\Footprints\HDR_M_2.54_1x2.PcbLib; ComponentLink4Description: Open Footprint; ComponentLink5Description: Open Footprint 2; ComponentLink6Description: Open Footprint 3; ComponentLink7Description: Open Footprint 4; Type: Header 2.54mm; Category: Connector; Supplier 1: Digi-Key; Supplier Part Number 1: 732-5315-ND; Quantity Override: 1; Manufacturer 2: SHENZHEN JUNHAO ENGINEERING; Manufacturer Part Number 2: R-211-0211-0021-000; Supplier 2: SHENZHEN JUNHAO ENGINEERING; Supplier Part Number 2: R-211-0211-0021-000; Assembly Type: TH
JP1 JP2 = MECH0174: Manufacturer 1: Wurth Electronics Inc.; Manufacturer Part Number 1: 60900213421; Value: Shunt 2.54mm 1x2; Description_: MECH HW JUMPER 2.54mm 1x2 GOLD; Dev Tools Status: Production; Owner: Narasimha Murthy; Populated: MECH; MCHP-ID: MECH0174; Revision: 1; Symbol: Jumper Mechanical; Status: MCL Design; ComponentLink1URL: https://chn-vm-apps.microchip.com/mchprepo/parts/Datasheets/60900213421.pdf; ComponentLink1Description: SVN Datasheet; ComponentLink2URL: C:\ALTIUM_WORK\00001_MCHP-CDB\Datasheets\60900213421.pdf; ComponentLink2Description: Local Datasheet; ComponentLink3URL: C:\ALTIUM_WORK\00001_MCHP-CDB\Library\LibraryRefs\Jumper Mechanical.SchLib; ComponentLink3Description: Open Symbol; ComponentLink4URL: C:\ALTIUM_WORK\00001_MCHP-CDB\Library\Footprints\Jumper_Mechanical.PcbLib; ComponentLink4Description: Open Footprint; ComponentLink5Description: Open Footprint 2; ComponentLink6Description: Open Footprint 3; ComponentLink7Description: Open Footprint 4; Type: Jumper; Category: Hardware; Supplier 1: Digi-Key; Supplier Part Number 1: 732-2678-ND; Quantity Override: 1
L1 L2 = IND1912: Manufacturer 1: TDK; Manufacturer Part Number 1: VLS3012CX-1R0M-1; Description_: INDUCTOR 1uH 2.51A 20% SMD L3W3H1.2; Dev Tools Status: Design; Owner: Cristina Salanti; DCR: 0.044R; Saturation Current: 2.79A; RMS Current: 3.31A; Test Frequency: 1Mhz; Populated: YES; Restricted Sourcing: No; MCHP-ID: IND1912; Revision: 1; Symbol: INDUCTOR; Status: MCL Design; ComponentLink1URL: https://chn-vm-apps.microchip.com/mchprepo/parts/Datasheets/inductor_commercial_power_vls3012cx-1_en.pdf; ComponentLink1Description: SVN Datasheet; ComponentLink2URL: C:\ALTIUM_WORK\00001_MCHP-CDB\Datasheets\inductor_commercial_power_vls3012cx-1_en.pdf; ComponentLink2Description: Local Datasheet; ComponentLink3URL: C:\ALTIUM_WORK\00001_MCHP-CDB\Library\LibraryRefs\INDUCTOR.SchLib; ComponentLink3Description: Open Symbol; ComponentLink4URL: C:\ALTIUM_WORK\00001_MCHP-CDB\Library\Footprints\IND_C_1212.PcbLib; ComponentLink4Description: Open Footprint; ComponentLink5Description: Open Footprint 2; ComponentLink6Description: Open Footprint 3; ComponentLink7Description: Open Footprint 4; Operating Temperature: -40°C ~ +105°C; Package: 3012; Type: Inductor; Category: Inductor; Supplier 1: Mouser; Supplier Part Number 1: 810-VLS3012CX-1R0M-1; Quantity Override: 1
Q1-Q5 = TRA1639: Transistor MOS; Manufacturer 1: Alpha & Omega Semiconductor Inc.; Manufacturer Part Number 1: AOSP21321; Description_: TRANS FET P-CH AOSP2132130V 11A 3.1W SOIC-8; Dev Tools Status: Design; Type: FET; Current: 11A; Drain to Source Voltage: 30V; Gate to Source Voltage: 25V; Power: 3.1W; Populated: YES; Owner: Dragos Danaila; MCHP-ID: TRA1639; Revision: 1; Symbol: Transistor MOS-P SSSGDDDD; Status: MCL Design; Package: SOIC 8; ComponentLink1URL: https://chn-vm-apps.microchip.com/mchprepo/parts/Datasheets/AOSP21321.pdf; ComponentLink1Description: SVN Datasheet; ComponentLink2URL: C:\ALTIUM_WORK\00001_MCHP-CDB\Datasheets\AOSP21321.pdf; ComponentLink2Description: Local Datasheet; ComponentLink3URL: C:\ALTIUM_WORK\00001_MCHP-CDB\Library\LibraryRefs\Transistor MOS-P SSSGDDDD.SchLib; ComponentLink3Description: Open Symbol; ComponentLink4URL: C:\ALTIUM_WORK\00001_MCHP-CDB\Library\Footprints\SOIC-8.PcbLib; ComponentLink4Description: Open Footprint; ComponentLink5Description: Open Footprint 2; ComponentLink6Description: Open Footprint 3; ComponentLink7Description: Open Footprint 4; Operating Temperature: -55C to +150C; Category: Transistor; Supplier 1: Digi-Key; Supplier Part Number 1: 785-1795-2-ND; Quantity Override: 1
Q6 Q7 = MIC7420: Transistor MOS; Manufacturer 1: Microchip Technology; Manufacturer Part Number 1: TN2106K1-G; Description_: MCHP ANALOG MOSFET N-CH TN2106 60V 280mA 360mW 2.5R SOT23-3; Type: MOSFET; Dev Tools Status: Production; Owner: Ilie Galan; Populated: YES; MCHP-ID: MIC7420; Symbol: Transistor MOS-N GSD; Status: MCL Design; Revision: 1; Category: MCHP-Analog; ComponentLink1Description: SVN Datasheet; ComponentLink2URL: C:\ALTIUM_WORK\00001_MCHP-CDB\Datasheets\TN2106 B080913.pdf; ComponentLink2Description: Local Datasheet; ComponentLink3URL: C:\ALTIUM_WORK\00001_MCHP-CDB\Library\LibraryRefs\Transistor MOS-N GSD.SchLib; ComponentLink3Description: Open Symbol; ComponentLink4URL: C:\ALTIUM_WORK\00001_MCHP-CDB\Library\Footprints\SOT-23-3.PcbLib; ComponentLink4Description: Open Footprint; ComponentLink5Description: Open Footprint 2; ComponentLink6Description: Open Footprint 3; ComponentLink7Description: Open Footprint 4; Supplier 1: Microchip Technology; Supplier Part Number 1: TN2106K1-G; Quantity Override: 1
R1 R7 = RSMT1294: Manufacturer 1: Panasonic Electronic Components; Manufacturer Part Number 1: ERJ-PA2F51R0X; Description_: RES TKF 51R 1% 1/5W SMD 0402; Dev Tools Status: Design; Voltage: 50V; Temperature Coeffcient: 100ppm/C; Power: 1/5W; Owner: Dragos Danaila; Populated: YES; MCHP-ID: RSMT1294; Revision: 1; Symbol: Resistor; Status: MCL Design; ComponentLink1URL: https://chn-vm-apps.microchip.com/mchprepo/parts/Datasheets/AOA0000C331.pdf; ComponentLink1Description: SVN Datasheet; ComponentLink2URL: C:\ALTIUM_WORK\00001_MCHP-CDB\Datasheets\AOA0000C331.pdf; ComponentLink2Description: Local Datasheet; ComponentLink3URL: C:\ALTIUM_WORK\00001_MCHP-CDB\Library\LibraryRefs\Resistor.SchLib; ComponentLink3Description: Open Symbol; ComponentLink4URL: C:\ALTIUM_WORK\00001_MCHP-CDB\Library\Footprints\RES_C_0402.PcbLib; ComponentLink4Description: Open Footprint; ComponentLink5Description: Open Footprint 2; ComponentLink6Description: Open Footprint 3; ComponentLink7Description: Open Footprint 4; Operating Temperature: -55C to +155C; Category: Resistor; Type: RES SMD; Composition: TKF; Supplier 1: Digikey; Supplier Part Number 1: P124491CT-ND; Quantity Override: 1
R2 = RES2553: Manufacturer 1: Stackpole Electronics Inc; Manufacturer Part Number 1: RMCF0402FT95K3; Description_: RES TKF 95.3k 1% 1/16W SMD 0402 AEC-Q200; Dev Tools Status: Production; Temperature Coefficient: 100ppm/C; Power: 1/16W; Owner: Narasimha Murthy; Populated: YES; Restricted Sourcing: No; MCHP-ID: RES2553; Revision: 1; Symbol: RESISTOR; Status: MCL Design; ComponentLink1URL: https://chn-vm-apps.microchip.com/mchprepo/parts/Datasheets/sei-rmcf_rmcp.pdf; ComponentLink1Description: SVN Datasheet; ComponentLink2URL: C:\ALTIUM_WORK\00001_MCHP-CDB\Datasheets\sei-rmcf_rmcp.pdf; ComponentLink2Description: Local Datasheet; ComponentLink3URL: C:\ALTIUM_WORK\00001_MCHP-CDB\Library\LibraryRefs\RESISTOR.SchLib; ComponentLink3Description: Open Symbol; ComponentLink4URL: C:\ALTIUM_WORK\00001_MCHP-CDB\Library\Footprints\RES_C_0402.PcbLib; ComponentLink4Description: Open Footprint; ComponentLink5Description: Open Footprint 2; ComponentLink6Description: Open Footprint 3; ComponentLink7Description: Open Footprint 4; Operating Temperature: -55C to 155C; Category: Resistor; Type: RES SMD; Composition: TKF; Supplier 1: Digi-Key; Supplier Part Number 1: RMCF0402FT95K3CT-ND; Quantity Override: 1
R3 R6 R9 = RES1011: Manufacturer 1: Panasonic; Manufacturer Part Number 1: ERJ-2RKF1003X; Description_: RES TKF 100k 1% 1/10W SMD 0402; Dev Tools Status: Production; Voltage: 50V; Temperature Coeffcient: 100ppm/C; Power: 1/10W; Owner: Tad Ahlvers; Populated: YES; MCHP-ID: RES1011; Revision: 1; Symbol: Resistor; Status: MCL Design; ComponentLink1URL: https://chn-vm-apps.microchip.com/mchprepo/parts/Datasheets/AOA0000CE2.pdf; ComponentLink1Description: SVN Datasheet; ComponentLink2URL: C:\ALTIUM_WORK\00001_MCHP-CDB\Datasheets\AOA0000CE2.pdf; ComponentLink2Description: Local Datasheet; ComponentLink3URL: C:\ALTIUM_WORK\00001_MCHP-CDB\Library\LibraryRefs\Resistor.SchLib; ComponentLink3Description: Open Symbol; ComponentLink4URL: C:\ALTIUM_WORK\00001_MCHP-CDB\Library\Footprints\RES_C_0402.PcbLib; ComponentLink4Description: Open Footprint; ComponentLink5Description: Open Footprint 2; ComponentLink6Description: Open Footprint 3; ComponentLink7Description: Open Footprint 4; Operating Temperature: -55C to +125C; Category: Resistor; Type: RES SMD; Composition: TKF; Supplier 1: Digi-Key; Supplier Part Number 1: P100KLCT-ND; Quantity Override: 1
R4 = RSMT1081: Manufacturer 1: Panasonic Electronic Components; Manufacturer Part Number 1: ERJ-2RKF2202X; Description_: RES TKF 22k 1% 1/10W SMD 0402; Dev Tools Status: Production; Voltage: 50V; Temperature Coefficient: 100ppm/C; Power: 1/10W; Owner: Bogdan Popescu; Populated: YES; MCHP-ID: RSMT1081; Revision: 1; Symbol: Resistor; Status: MCL Design; ComponentLink1URL: https://chn-vm-apps.microchip.com/mchprepo/parts/Datasheets/AOA0000CE2.pdf; ComponentLink1Description: SVN Datasheet; ComponentLink2URL: C:\ALTIUM_WORK\00001_MCHP-CDB\Datasheets\AOA0000CE2.pdf; ComponentLink2Description: Local Datasheet; ComponentLink3URL: C:\ALTIUM_WORK\00001_MCHP-CDB\Library\LibraryRefs\Resistor.SchLib; ComponentLink3Description: Open Symbol; ComponentLink4URL: C:\ALTIUM_WORK\00001_MCHP-CDB\Library\Footprints\RES_C_0402.PcbLib; ComponentLink4Description: Open Footprint; ComponentLink5Description: Open Footprint 2; ComponentLink6Description: Open Footprint 3; ComponentLink7Description: Open Footprint 4; Operating Temperature: -55C to +155C; Category: Resistor; Type: RES SMD; Composition: TKF; Supplier 1: Digi-Key; Supplier Part Number 1: P22.0KLCT-ND; Quantity Override: 1
R5 = RSMT1019: Manufacturer 1: Panasonic; Manufacturer Part Number 1: ERJ-2RKF1002X; Description_: RES TKF 10k 1% 1/10W SMD 0402; Dev Tools Status: Production; Voltage: 50V; Temperature Coeffcient: 100ppm/C; Power: 1/10W; Owner: Brent Lanphear; Populated: Yes; MCHP-ID: RSMT1019; Revision: 2; Symbol: Resistor; Status: MCL Design; ComponentLink1URL: https://chn-vm-apps.microchip.com/mchprepo/parts/Datasheets/AOA0000CE2.pdf; ComponentLink1Description: SVN Datasheet; ComponentLink2URL: C:\ALTIUM_WORK\00001_MCHP-CDB\Datasheets\AOA0000CE2.pdf; ComponentLink2Description: Local Datasheet; ComponentLink3URL: C:\ALTIUM_WORK\00001_MCHP-CDB\Library\LibraryRefs\Resistor.SchLib; ComponentLink3Description: Open Symbol; ComponentLink4URL: C:\ALTIUM_WORK\00001_MCHP-CDB\Library\Footprints\RES_C_0402.PcbLib; ComponentLink4Description: Open Footprint; ComponentLink5Description: Open Footprint 2; ComponentLink6Description: Open Footprint 3; ComponentLink7Description: Open Footprint 4; Operating Temperature: -55C to +155C; Category: Resistor; Type: RES SMD; Composition: TKF; Supplier 1: Digi-Key; Supplier Part Number 1: P10.0KLCT-ND; Quantity Override: 1
R8 = RES2744: Manufacturer 1: Panasonic; Manufacturer Part Number 1: ERJ-U02F9102X; Description_: RES TKF 91k 1% 1/10W SMD 0402; Dev Tools Status: Production; Voltage: 50V; Owner: Octavian Stroe; Populated: YES; Restricted Sourcing: No; MCHP-ID: RES2744; Revision: 3; Symbol: Resistor; Status: MCL Design; ComponentLink1Description: SVN Datasheet; ComponentLink2Description: Local Datasheet; ComponentLink3URL: C:\ALTIUM_WORK\00001_MCHP-CDB\Library\LibraryRefs\Resistor.SchLib; ComponentLink3Description: Open Symbol; ComponentLink4URL: C:\ALTIUM_WORK\00001_MCHP-CDB\Library\Footprints\RES_C_0402.PcbLib; ComponentLink4Description: Open Footprint; ComponentLink5Description: Open Footprint 2; ComponentLink6Description: Open Footprint 3; ComponentLink7Description: Open Footprint 4; Category: Resistor; Type: RES SMD; Composition: TKF; Supplier 1: Digi-Key; Supplier Part Number 1: 10-ERJ-U02F9102XCT-ND; Quantity Override: 1
R10 = RES1960: Manufacturer 1: Panasonic Electronic Components; Manufacturer Part Number 1: ERJ-2RKF3002X; Description_: RES TKF 30K 1% 1/10W SMD 0402; Dev Tools Status: Production; Voltage: 50V; Temperature Coefficient: ±100ppm/°C; Power: 1/10W; Owner: Jennifer Hancock; Populated: YES; Restricted Sourcing: No; MCHP-ID: RES1960; Revision: 1; Symbol: resistor; Status: MCL Design; ComponentLink1URL: https://chn-vm-apps.microchip.com/mchprepo/parts/Datasheets/ERJ Series_Precision.pdf; ComponentLink1Description: SVN Datasheet; ComponentLink2URL: C:\ALTIUM_WORK\00001_MCHP-CDB\Datasheets\ERJ Series_Precision.pdf; ComponentLink2Description: Local Datasheet; ComponentLink3URL: C:\ALTIUM_WORK\00001_MCHP-CDB\Library\LibraryRefs\resistor.SchLib; ComponentLink3Description: Open Symbol; ComponentLink4URL: C:\ALTIUM_WORK\00001_MCHP-CDB\Library\Footprints\RES_C_0402.PcbLib; ComponentLink4Description: Open Footprint; ComponentLink5Description: Open Footprint 2; ComponentLink6Description: Open Footprint 3; ComponentLink7Description: Open Footprint 4; Operating Temperature: -55°C to +155°C; Category: Resistor; Type: RES SMD; Composition: TKF; Supplier 1: Digi-Key; Supplier Part Number 1: P30.0KLCT-ND; Quantity Override: 1
R11 R12 = RES2489: Manufacturer 1: Vishay; Manufacturer Part Number 1: CRCW06035K10FKEA; Description_: RES TKF 5.1k 1% 1/10W SMD 0603 AEC-Q200; Dev Tools Status: Design; Voltage: 100V; Temperature Coefficient: 100ppm/C; Power: 1/10W; Owner: Cristina Salanti; Restricted Sourcing: No; MCHP-ID: RES2489; Revision: 2; Symbol: Resistor; Status: MCL Design; ComponentLink1URL: https://chn-vm-apps.microchip.com/mchprepo/parts/Datasheets/dcrcwe3.pdf; ComponentLink1Description: SVN Datasheet; ComponentLink2URL: C:\ALTIUM_WORK\00001_MCHP-CDB\Datasheets\dcrcwe3.pdf; ComponentLink2Description: Local Datasheet; ComponentLink3URL: C:\ALTIUM_WORK\00001_MCHP-CDB\Library\LibraryRefs\Resistor.SchLib; ComponentLink3Description: Open Symbol; ComponentLink4URL: C:\ALTIUM_WORK\00001_MCHP-CDB\Library\Footprints\RES_C_0603.PcbLib; ComponentLink4Description: Open Footprint; ComponentLink5Description: Open Footprint 2; ComponentLink6Description: Open Footprint 3; ComponentLink7Description: Open Footprint 4; Operating Temperature: -55C to +155C; Category: Resistor; Type: RES SMD; Composition: TKF; Supplier 1: Digi-Key; Supplier Part Number 1: 541-5.10KHCT-ND; Quantity Override: 1
R13 = RSMT1019: Manufacturer 1: Panasonic; Manufacturer Part Number 1: ERJ-2RKF1002X; Description_: RES TKF 10k 1% 1/10W SMD 0402; Dev Tools Status: Production; Temperature Coeffcient: 100ppm/C; Power: 1/10W; Owner: Brent Lanphear; Populated: Yes; Voltage: 50V; MCHP-ID: RSMT1019; Revision: 2; Symbol: Resistor; Status: MCL Design; ComponentLink1URL: https://chn-vm-apps.microchip.com/mchprepo/parts/Datasheets/AOA0000CE2.pdf; ComponentLink1Description: SVN Datasheet; ComponentLink2URL: C:\ALTIUM_WORK\00001_MCHP-CDB\Datasheets\AOA0000CE2.pdf; ComponentLink2Description: Local Datasheet; ComponentLink3URL: C:\ALTIUM_WORK\00001_MCHP-CDB\Library\LibraryRefs\Resistor.SchLib; ComponentLink3Description: Open Symbol; ComponentLink4URL: C:\ALTIUM_WORK\00001_MCHP-CDB\Library\Footprints\RES_C_0402.PcbLib; ComponentLink4Description: Open Footprint; ComponentLink5Description: Open Footprint 2; ComponentLink6Description: Open Footprint 3; ComponentLink7Description: Open Footprint 4; Category: Resistor; Type: RES SMD; Composition: TKF; Supplier 1: Digi-Key; Supplier Part Number 1: P10.0KLCT-ND; Quantity Override: 1; Operating Temperature: -55C to +155C
R14 = RSMT1298: Manufacturer 1: Stackpole Electronics Inc; Manufacturer Part Number 1: RMCF0402FT20K0; Description_: RES TKF 20k 1% 1/10W SMD 0402; Dev Tools Status: Design; Temperature Coeffcient: 100ppm/C; Power: 1/16W; Owner: Dragos Danaila; Populated: YES; Voltage: 50V; MCHP-ID: RSMT1298; Revision: 1; Symbol: Resistor; Status: MCL Design; ComponentLink1URL: https://chn-vm-apps.microchip.com/mchprepo/parts/Datasheets/sei-rmcf_rmcp.pdf; ComponentLink1Description: SVN Datasheet; ComponentLink2URL: C:\ALTIUM_WORK\00001_MCHP-CDB\Datasheets\sei-rmcf_rmcp.pdf; ComponentLink2Description: Local Datasheet; ComponentLink3URL: C:\ALTIUM_WORK\00001_MCHP-CDB\Library\LibraryRefs\Resistor.SchLib; ComponentLink3Description: Open Symbol; ComponentLink4URL: C:\ALTIUM_WORK\00001_MCHP-CDB\Library\Footprints\RES_C_0402.PcbLib; ComponentLink4Description: Open Footprint; ComponentLink5Description: Open Footprint 2; ComponentLink6Description: Open Footprint 3; ComponentLink7Description: Open Footprint 4; Operating Temperature: -55C to +155C; Category: Resistor; Type: RES SMD; Composition: TKF; Supplier 1: Digikey; Supplier Part Number 1: RMCF0402FT20K0CT-ND; Quantity Override: 1
U1 = MIC6782: Manufacturer 1: Microchip Technology; Manufacturer Part Number 1: MIC23450-AAAYML-TR; Description_: MCHP ANALOG SWITCHER Buck 0.62V to 3.3V MIC23450 QFN-32; Dev Tools Status: Production; Owner: Razvan Cristescu; Populated: YES; MCHP-ID: MIC6782; Symbol: MIC23450 QFN-32; Type: Switcher; Status: MCL Design; Revision: 1; Category: MCHP-Analog; ComponentLink1URL: https://chn-vm-apps.microchip.com/mchprepo/parts/Datasheets/MIC23450.pdf; ComponentLink1Description: SVN Datasheet; ComponentLink2URL: C:\ALTIUM_WORK\00001_MCHP-CDB\Datasheets\MIC23450.pdf; ComponentLink2Description: Local Datasheet; ComponentLink3URL: C:\ALTIUM_WORK\00001_MCHP-CDB\Library\LibraryRefs\MIC23450 QFN-32.SchLib; ComponentLink3Description: Open Symbol; ComponentLink4URL: C:\ALTIUM_WORK\00001_MCHP-CDB\Library\Footprints\QFN-32_5X5_EP3.1X3.1.PcbLib; ComponentLink4Description: Open Footprint; ComponentLink5Description: Open Footprint 2; ComponentLink6Description: Open Footprint 3; ComponentLink7Description: Open Footprint 4; Supplier 1: Microchip Technology; Supplier Part Number 1: MIC23450-AAAYML-TR; Operating Temperature: -40C to +125C; Quantity Override: 1